# EAGLE design batboard_rev2 (EAGLE 6.4)
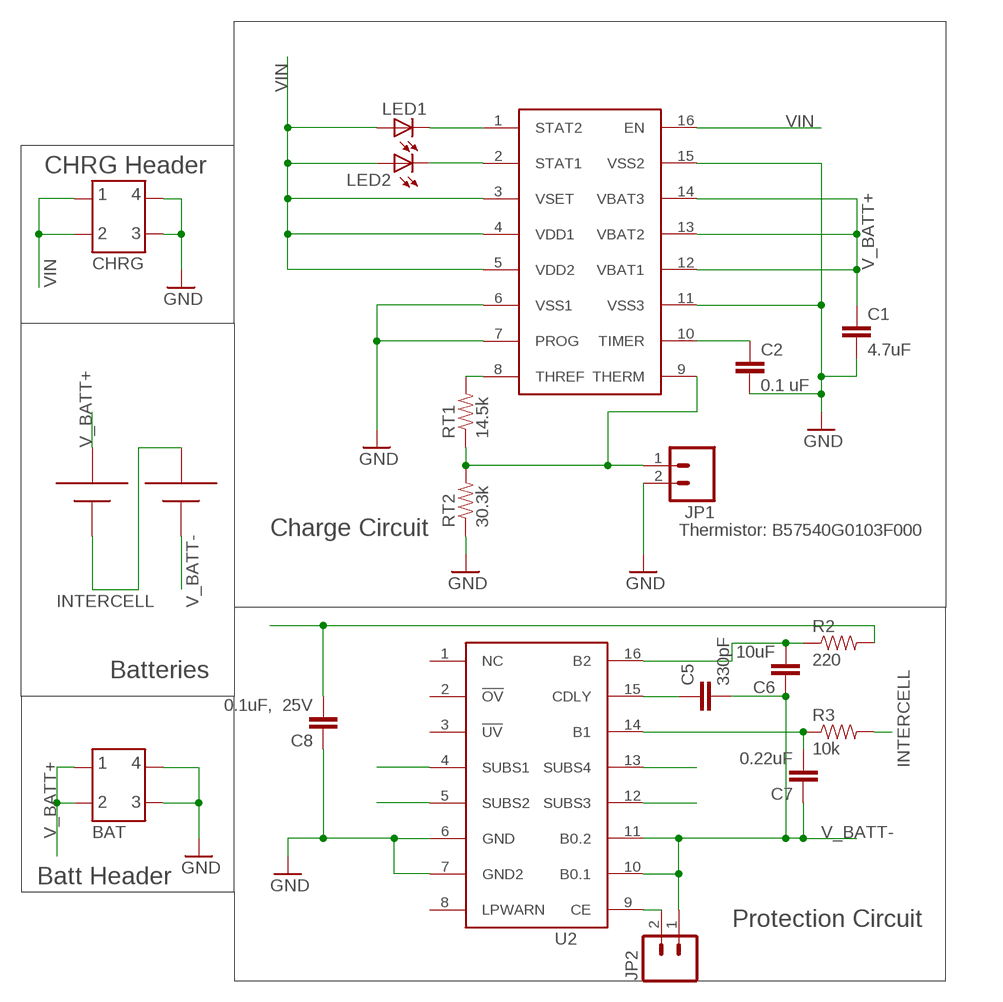
[diagram p0: schematic, sheet 1]

## Parts
BAT  C-GRID-71308  [4HEAD_MOLEX_C71308]
C1  4.7uF  CAP0805  [0805]
C2  0.1 uF  CAP0805  [0805]
C5  330pF  CAP0805  [0805]
C6  10uF  CAP0805  [0805]
C7  0.22uF  CAP0805  [0805]
C8  0.1uF, 25V  CAP0805  [0805]
CHRG  C-GRID-71308  [4HEAD_MOLEX_C71308]
JP1  M02PTH  [1X02]
JP2  M02PTH  [1X02]
LED1  LED1206  [LED-1206]
LED2  LED1206  [LED-1206]
R2  220  RESISTOR0603-RES  [0603-RES]
R3  10k  RESISTOR0603-RES  [0603-RES]
RT1  14.5k  RESISTOR0603-RES  [0603-RES]
RT2  30.3k  RESISTOR0603-RES  [0603-RES]
U1  MCP73862  [SOIC-16]
U2  UCC3911  [SOIC-16]
U$1  BK-18650-PC4  [18650-PC4]

## Nets
GND: BAT.3 BAT.4 C1.2 C2.2 C8.1 CHRG.3 CHRG.4 JP1.2 RT2.1 U1.6(VSS1) U1.7(PROG) U1.11(VSS3) U1.15(VSS2) U2.6(GND) U2.7(GND2)
HSINK: U2.4(SUBS1) U2.5(SUBS2) U2.12(SUBS3) U2.13(SUBS4)
INTERCELL: R3.2 U$1.+2 U$1.-1
N$1: JP2.2 U2.9(CE)
N$3: JP1.1 RT1.1 RT2.2 U1.9(THERM)
N$4: LED1.C U1.1(STAT2)
N$5: LED2.C U1.2(STAT1)
N$6: C2.1 U1.10(TIMER)
N$7: RT1.2 U1.8(THREF)
N$9: C5.1 U2.15(CDLY)
N$10: C6.2 R2.1 U2.16(B2)
N$13: C7.2 R3.1 U2.14(B1)
V_BATT+: BAT.1 BAT.2 C1.1 C8.2 R2.2 U1.12(VBAT1) U1.13(VBAT2) U1.14(VBAT3) U$1.+1
V_BATT-: C5.2 C6.1 C7.1 JP2.1 U2.10(B0.1) U2.11(B0.2) U$1.-2
VIN: CHRG.1 CHRG.2 LED1.A LED2.A U1.3(VSET) U1.4(VDD1) U1.5(VDD2) U1.16(EN)
Unconnected: U2.1(NC) U2.2(!OV) U2.3(!UV) U2.8(LPWARN)

## Notes on the sheet
- CHRG Header
- Charge Circuit | Thermistor: B57540G0103F000
- Batteries
- Batt Header
- Protection Circuit

## Library data of the parts
BAT CHRG = jabinder:C-GRID-71308: 4 Pin SMT Molex HEADER Digikey: WM17450-ND
C1 C2 C5-C8 = SparkFun-Capacitors:CAP: Capacitor Standard 0603 ceramic capacitor, and 0.1" leaded capacitor.
JP1 JP2 = SparkFun-Connectors:M02: Header 2 Standard 2-pin 0.1" header. Use with straight break away headers (SKU : PRT-00116), right angle break away headers (PRT-00553), swiss pins (PRT-00743), machine pins (PRT-00117), and female headers (PRT-00115). Molex polarized connector foot print use with SKU : PRT-08233 with associated crimp pins and housings.
LED1 LED2 = SparkFun-LED:LED: LEDs Standard schematic elements and footprints for 5mm, 3mm, 1206, and 0603 sized LEDs. 5mm - Spark Fun Electronics SKU : COM-00529 (and others)
R2 R3 RT1 RT2 = SparkFun-Passives:RESISTOR: Resistor Basic schematic elements and footprints for 0603, 1206, and PTH resistors.
U1 = jabinder:MCP73862
U2 = jabinder:UCC3911
U$1 = jabinder:BK-18650-PC4

## Board
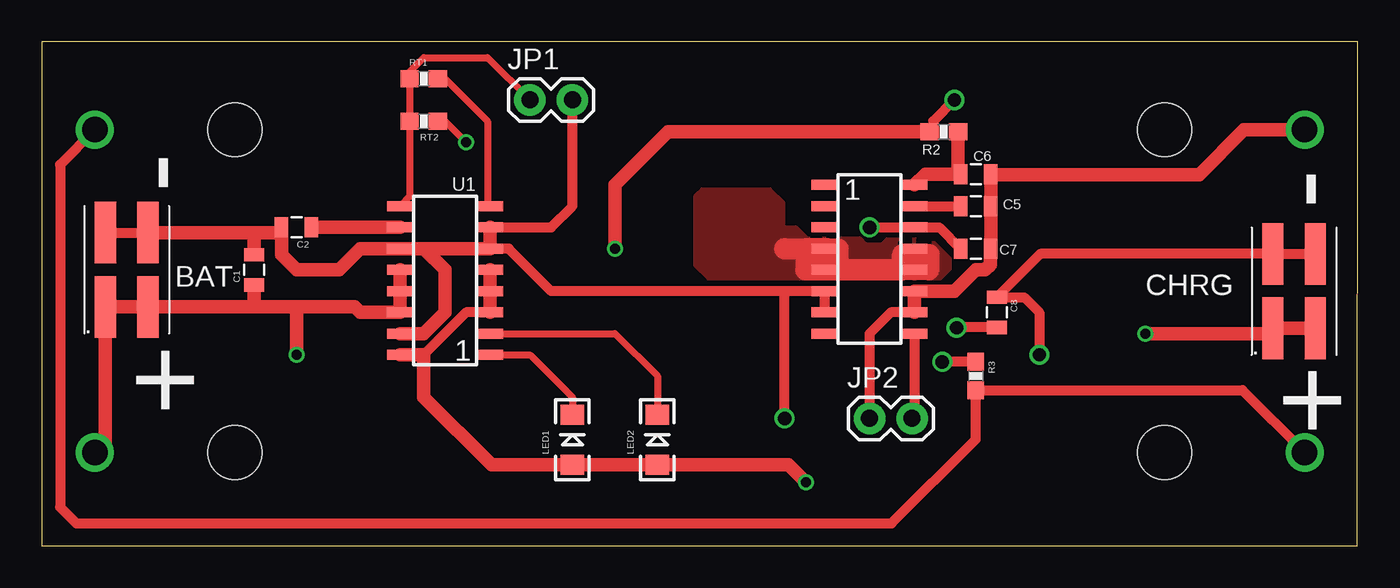
[diagram p1: board, top side]
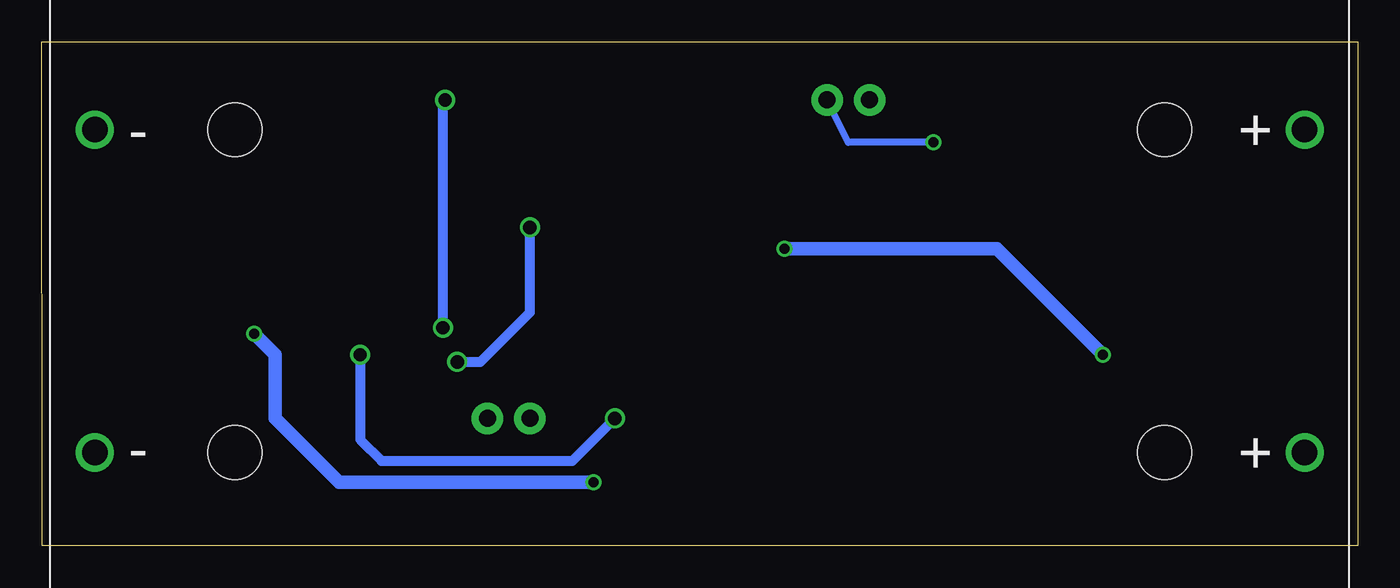
[diagram p2: board, bottom side, seen from below]

Size 78.74 x 30.15 mm. Coordinates in mm from the lower left corner, seen from the top.
Outline: 0,0 78.72,0 78.74,30.15 0,30.15 0,0
Copper layers (1*16): Top 0.0356mm / dielectric 1.5011mm / Bottom 0.0356mm
Design rules "LaenPCBOrder": minimum track width 6mil, minimum drill 13mil, track to track 6mil, track to pad 6mil, pad to pad 6mil, via to via 6mil, smd to smd 6mil, copper to edge 15mil, drill to drill 6mil, minimum pad ring 7mil, minimum via ring 7mil, stop-mask expansion 4mil, vias tented up to drill 0mil, thermal gap 10mil

### Footprints (pad centres in the part's own frame; a part is rotated, then mirrored left to right if it is on the bottom)
4HEAD_MOLEX_C71308 = smd 1.27 x 3.683: 1 -1.27,-2.223; 2 1.27,-2.223; 3 1.27,2.223; 4 -1.27,2.223
0805 = smd 0.8 x 1.2: 1 -0.9,0; 2 0.9,0
1X02 = drill 1.016 pad 1.88: 1 0,0; 2 2.54,0
LED-1206 = smd 1.2 x 1.4: A -1.5,0; C 1.5,0
0603-RES = smd 1.1 x 1: 1 -0.85,0; 2 0.85,0
SOIC-16 = smd 0.6 x 1.55: 1 -3.81,-2.7; 2 -2.54,-2.7; 3 -1.27,-2.7; 4 0,-2.7; 5 1.27,-2.7; 6 2.54,-2.7; 7 3.81,-2.7; 8 5.08,-2.7; 9 5.08,2.7; 10 3.81,2.7; 11 2.54,2.7; 12 1.27,2.7; 13 0,2.7; 14 -1.27,2.7; 15 -2.54,2.7; 16 -3.81,2.7
18650-PC4 = drill 1.524: +1 -36.195,9.652; +2 -36.195,-9.652; -1 36.195,9.652; -2 36.195,-9.652 | hole 3.2: -27.813,9.652; -27.813,-9.652; 27.813,-9.652; 27.813,9.652

### Placement (x,y rotation side)
BAT  5.08,16.51 0 top
C1  12.7,16.51 90 top
C2  15.24,19.05 180 top
C5  55.88,20.32 0 top
C6  55.88,22.23 180 top
C7  55.88,17.78 180 top
C8  57.15,13.97 270 top
CHRG  74.93,15.24 0 top
JP1  29.21,26.67 0 top
JP2  49.53,7.62 0 top
LED1  31.75,6.35 90 top
LED2  36.83,6.35 90 top
R2  53.97,24.76 180 top
R3  55.88,10.16 270 top
RT1  22.86,27.94 0 top
RT2  22.86,25.4 180 top
U1  24.13,15.24 90 top
U2  49.53,17.78 270 top
U$1  39.37,15.24 180 bottom

### Tracks (layer width: path | path; a pad name or v marks a point on that pad's centre or on a via)
GND  (via drill 0.6, 0.8)
  Top 0.406: RT2.1 24.13,25.4 v25.4,24.13
  Top 0.61: BAT.4 BAT.3 | CHRG.3 CHRG.4 59.74,17.46 C8.1 58.79,14.87 59.69,13.97 v59.69,11.43 | U2.7 U2.6 44.45,15.24 | 44.45,15.24 30.48,15.24 27.94,17.78 U1.6 | v44.45,7.62 44.45,15.24 | U1.7 30.48,19.05 31.75,20.32 JP1.2
  Top 0.813: BAT.3 12.7,18.73 | 12.7,18.73 14.34,18.73 C2.2 14.34,17.41 15.24,16.51 17.78,16.51 19.05,17.78 U1.11 | U1.11 U1.6 U1.7 | U1.11 22.86,17.78 24.13,16.51 24.13,13.97 22.86,12.7 U1.15 | C1.2 12.7,18.73
  Bottom 0.406: v25.4,24.13 30.48,24.13 JP1.2
  Bottom 0.61: v59.69,11.43 59.69,6.35 58.42,5.08 46.99,5.08 v44.45,7.62
HSINK
  Top 1.27: 46.99,16.51 46.99,17.78 U2.4 45.72,17.78 45.72,16.51 51.5,16.51 51.5,17.43 53.09,17.43 53.09,17.15 53.08,17.15 53.08,16.5 47.66,16.5 47.66,17.76 44.45,17.76 44.45,17.78
  pour Top: 44.45,19.05 45.12,19.05 45.78,18.39 48.95,18.39 49.3,18.04 50.29,18.04 50.6,18.35 53.16,18.35 54.31,17.2 54.31,16.55 53.73,15.97 39.91,15.97 39.12,16.76 39.12,20.93 39.52,21.33 43.55,21.33 44.34,20.55 44.34,19.12 44.41,19.04 44.44,19.04
INTERCELL
  Top 0.61: U$1.+2 1.09,22.81 1.09,2.32 2.07,1.34 50.85,1.34 55.88,6.37 R3.2 71.84,9.31 U$1.-1
N$1
  Top 0.61: U2.9 52.23,7.78 JP2.2
N$3
  Top 0.406: U1.9 22.01,20.9 RT2.2 RT1.1 22.01,28.36 22.86,29.21 26.67,29.21 JP1.1
N$4
  Top 0.406: U1.1 29.21,11.43 31.75,8.89 LED1.C
N$5
  Top 0.406: U1.2 34.29,12.7 36.83,10.16 LED2.C
N$6
  Top 0.813: C2.1 U1.10
N$7
  Top 0.406: RT1.2 24.13,27.94 26.67,25.4 26.67,20.48 U1.8
N$9
  Top 0.61: U2.15 C5.1
N$10
  Top 0.813: R2.1 54.82,22.38 C6.2 52.86,22.23 U2.16
N$13  (via drill 0.8)
  Top 0.61: C7.2 53.71,19.05 U2.14 v49.53,19.05 | R3.1 53.89,11.01 v53.88,11
  Bottom 0.61: v53.88,11 52.5,11 49.53,13.97 v49.53,19.05
V_BATT+  (via drill 0.6, 0.8)
  Top 0.61: C8.2 54.76,13.07 v54.73,13.05 | v54.61,26.67 53.34,25.4 53.34,24.98 R2.2
  Top 0.813: U$1.+1 3.81,6.22 BAT.1 BAT.2 12.7,14.29 | 12.7,14.29 15.24,14.29 | 15.24,14.29 18.73,14.29 19.05,13.97 U1.14 U1.13 U1.12 | C1.1 12.7,14.29 | R2.2 37.46,24.76 34.29,21.59 v34.29,17.78 | v15.24,11.43 15.24,14.29
  Bottom 0.61: v54.73,13.05 54.73,26.55 v54.61,26.67
  Bottom 0.813: v34.29,17.78 21.59,17.78 v15.24,11.43
V_BATT-
  Top 0.61: U2.10 50.8,13.97 49.53,12.7 JP2.1
  Top 0.813: U$1.-2 71.93,24.89 69.25,22.21 56.8,22.21 C6.1 C5.2 C7.1 56.75,17.76 56.75,16.82 56.44,16.51 55.88,16.51 54.61,15.24 U2.11 U2.10
VIN  (via drill 0.6)
  Top 0.61: U1.3 25.4,13.97 22.86,11.43
  Top 0.813: CHRG.2 CHRG.1 73.34,12.7 v66.04,12.7 | U1.5 U1.4 U1.3 | U1.16 22.86,11.43 22.86,8.89 26.9,4.85 LED1.A LED2.A 44.68,4.85 v45.72,3.81
  Bottom 0.813: v45.72,3.81 60.96,3.81 64.77,7.62 64.77,11.43 v66.04,12.7

### Text on the board
tPlace: - | - | + | +